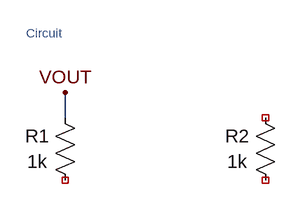
[diagram p0: schematic circuit.asc]
circuit.asc, the LTspice schematic file:
Version 4
SHEET 1 400 272
SYMBOL res 64 128 R0
WINDOW 0 -20 40 Center 2
WINDOW 3 -20 72 Center 2
SYMATTR InstName R1
SYMATTR Value 1k
SYMBOL res 320 128 R0
WINDOW 0 -20 40 Center 2
WINDOW 3 -20 72 Center 2
SYMATTR InstName R2
SYMATTR Value 1k
WIRE 80 112 80 144
FLAG 80 112 VOUT
TEXT 30 36 Left 1 ;Circuit

The netlist it stands for:
* circuit.asc
R1 VOUT NC_01 1k
R2 NC_02 NC_03 1k
* Circuit
.backanno
.end